# EAGLE design ARUv1 (EAGLE 6.1)
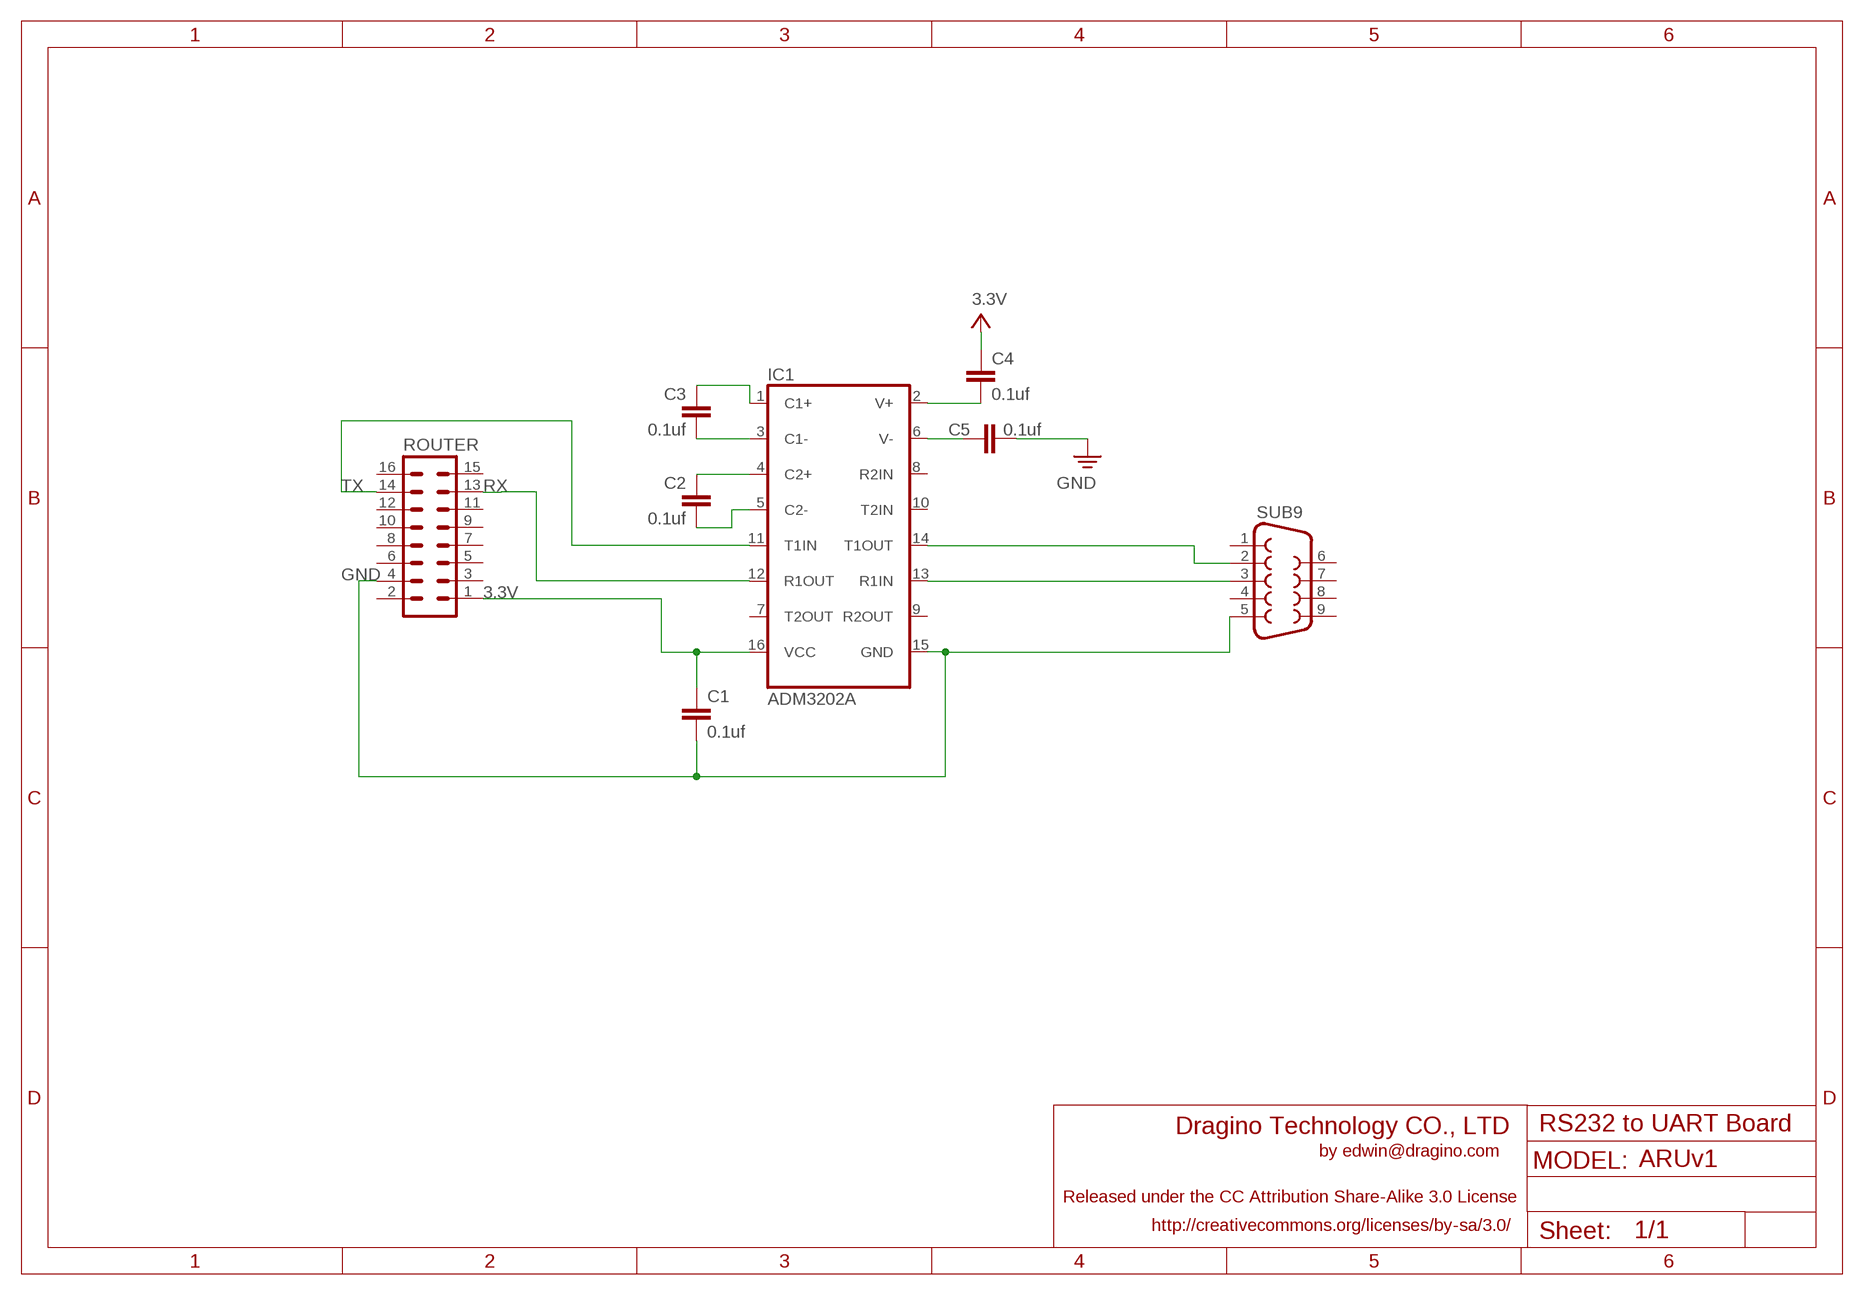
[diagram p0: schematic, sheet 1]

## Parts
C1  0.1uf  C-EUC0402  [C0402]
C2  0.1uf  C-EUC0402  [C0402]
C3  0.1uf  C-EUC0402  [C0402]
C4  0.1uf  C-EUC0402  [C0402]
C5  0.1uf  C-EUC0402  [C0402]
IC1  ADM3202A  MAX3221CUE  [TSSOP16]
ROUTER  MA08-2  [MA08-2]
SUB9  F09HP  [F09HP]

## Nets
3.3V: C1.1 C4.1 IC1.16(VCC) ROUTER.1
GND: C1.2 C5.1 IC1.15(GND) ROUTER.4 SUB9.5
N$1: C2.1 IC1.5(C2-)
N$2: C2.2 IC1.4(C2+)
N$3: C3.2 IC1.3(C1-)
N$4: C3.1 IC1.1(C1+)
N$5: C4.2 IC1.2(V+)
N$6: C5.2 IC1.6(V-)
N$7: IC1.14(T1OUT) SUB9.2
N$8: IC1.13(R1IN) SUB9.3
RX: IC1.12(R1OUT) ROUTER.13
TX: IC1.11(T1IN) ROUTER.14
Unconnected: IC1.7(T2OUT) IC1.8(R2IN) IC1.9(R2OUT) IC1.10(T2IN) ROUTER.2 ROUTER.3 ROUTER.5 ROUTER.6 ROUTER.7 ROUTER.8 ROUTER.9 ROUTER.10 ROUTER.11 ROUTER.12 ROUTER.15 ROUTER.16 SUB9.1 SUB9.4 SUB9.6 SUB9.7 SUB9.8 SUB9.9

## Notes on the sheet
- RS232 to UART Board

## Library data of the parts
C1-C5 = resistor:C-EU: CAPACITOR, European symbol
IC1 = maxim - ??:MAX3221*: RS-232 Transceivers with AutoShutdown 1µA Supply-Current, True +3V to +5.5V http://dbserv.maxim-ic.com/; MF: MAXIM; MPN: MAX3221CUE+; OC_FARNELL: 1379915; OC_NEWARK: 68K4608
ROUTER = con-lstb:MA08-2: PIN HEADER; OC_FARNELL: unknown; OC_NEWARK: unknown
SUB9 = con-subd:F09: SUB-D; OC_FARNELL: unknown; OC_NEWARK: unknown

## Board
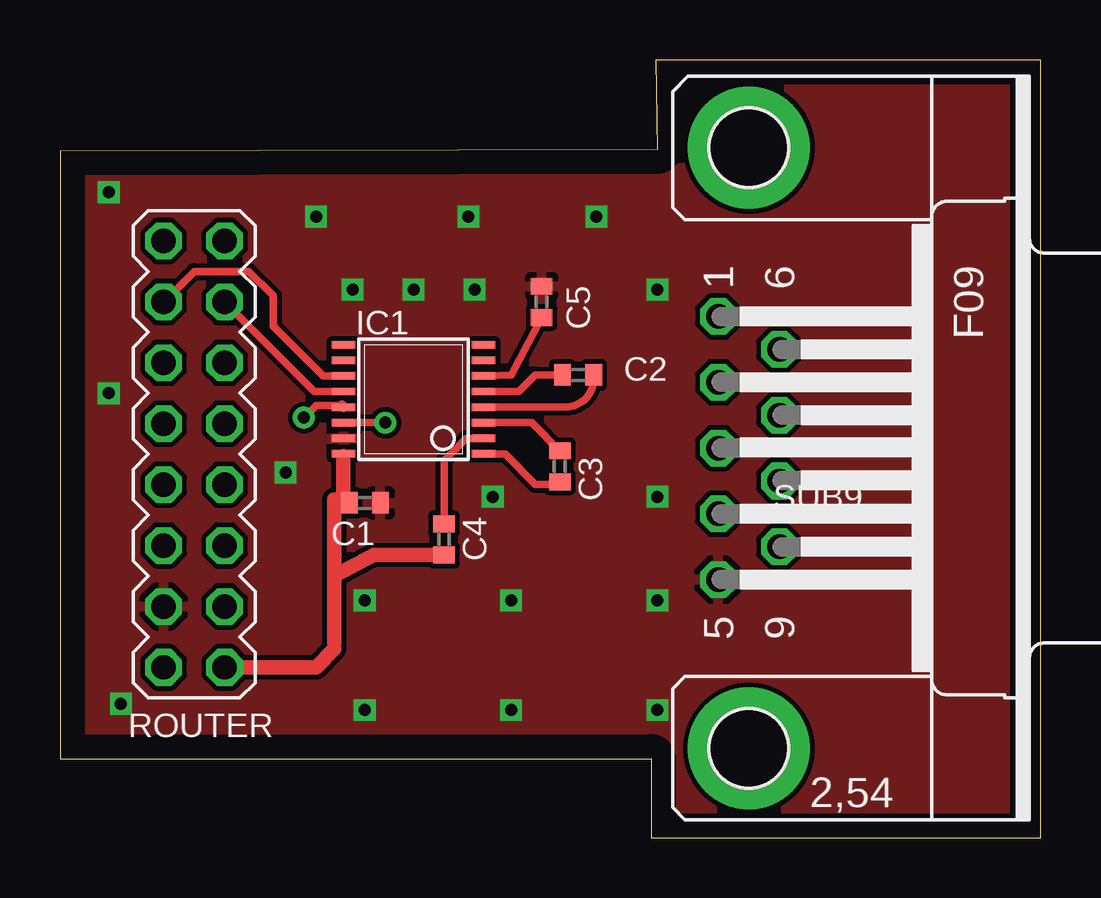
[diagram p1: board, top side]
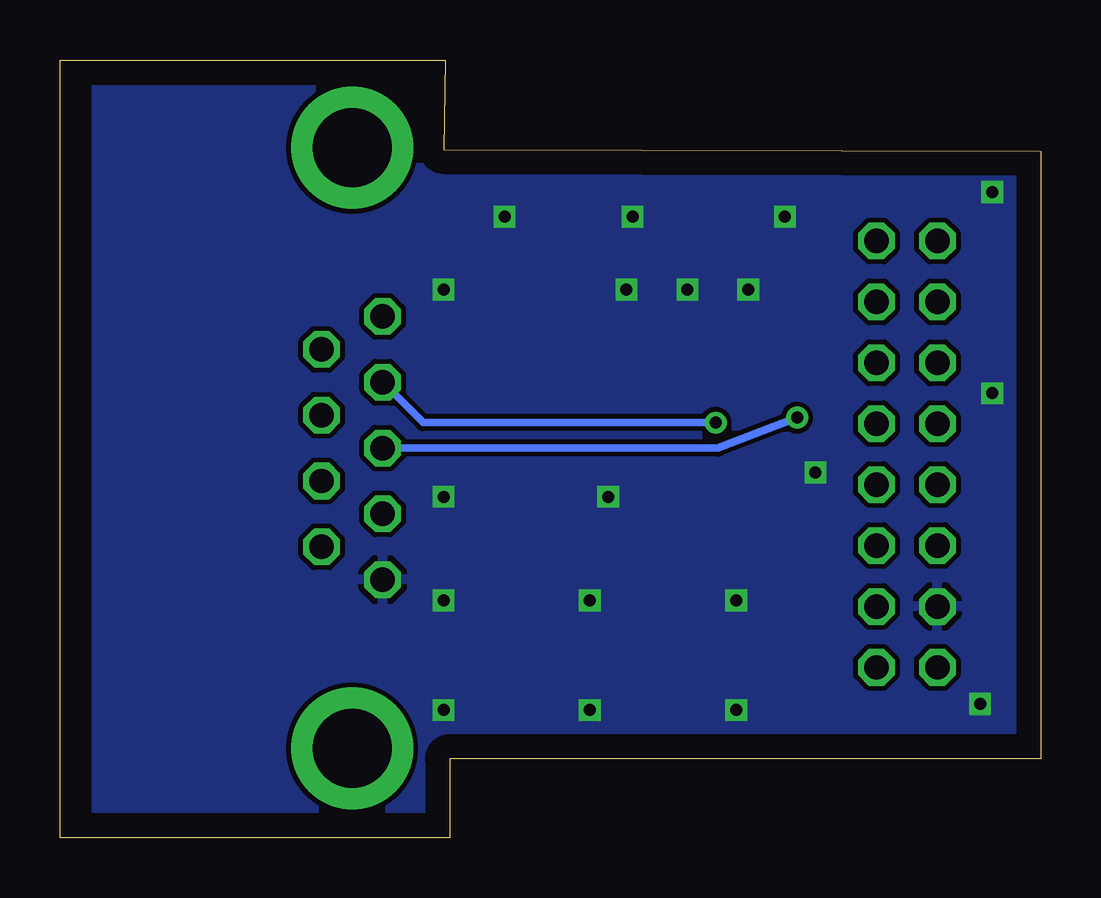
[diagram p2: board, bottom side, seen from below]

Size 40.87 x 32.44 mm. Coordinates in mm from the lower left corner, seen from the top.
Outline: 0,3.3 24.64,3.3 24.64,0 40.87,0 40.87,32.44 24.82,32.44 24.89,28.7 0,28.63 0,3.3
Copper layers (1*16): GND 0.035mm / dielectric 1.5mm / Bottom 0.035mm
Design rules: minimum track width 10mil, minimum drill 18mil, track to track 8mil, track to pad 8mil, pad to pad 8mil, via to via 8mil, smd to smd 8mil, copper to edge 40mil, drill to drill 8mil, minimum pad ring 10mil, minimum via ring 8mil, stop-mask expansion 4mil, vias tented up to drill 20mil, thermal gap 10mil

### Footprints (pad centres in the part's own frame; a part is rotated, then mirrored left to right if it is on the bottom)
C0402 = smd 0.7 x 0.9: 1 -0.65,0; 2 0.65,0
TSSOP16 = smd 0.305 x 0.991: 1 -2.275,-2.918; 2 -1.625,-2.918; 3 -0.975,-2.918; 4 -0.325,-2.918; 5 0.325,-2.918; 6 0.975,-2.918; 7 1.625,-2.918; 8 2.275,-2.918; 9 2.275,2.918; 10 1.625,2.918; 11 0.975,2.918; 12 0.325,2.918; 13 -0.325,2.918; 14 -0.975,2.918; 15 -1.625,2.918; 16 -2.275,2.918
MA08-2 = drill 1.016 octagon: 1 -8.89,-1.27; 2 -8.89,1.27; 3 -6.35,-1.27; 4 -6.35,1.27; 5 -3.81,-1.27; 6 -3.81,1.27; 7 -1.27,-1.27; 8 -1.27,1.27; 9 1.27,-1.27; 10 1.27,1.27; 11 3.81,-1.27; 12 3.81,1.27; 13 6.35,-1.27; 14 6.35,1.27; 15 8.89,-1.27; 16 8.89,1.27
F09HP = drill 1.016 octagon: 1 -5.486,-1.27; 2 -2.743,-1.27; 3 0,-1.27; 4 2.743,-1.27; 5 5.486,-1.27; 6 -4.115,1.27; 7 -1.372,1.27; 8 1.372,1.27; 9 4.115,1.27 | drill 3.302 pad 5.08: G1 -12.522,0; G2 12.522,0

### Placement (x,y rotation side)
C1  12.7,13.97 0 top
C2  21.59,19.3 0 top
C3  20.83,15.49 90 top
C4  16,12.45 90 top
C5  20.07,22.35 270 top
IC1  14.73,18.29 90 top
ROUTER  5.59,16 90 top
SUB9  28.7,16.26 270 top
U$1  [LOGO-SILK-15MM]  14.73,25.15 0 top

### Tracks (layer width: path | path; a pad name or v marks a point on that pad's centre or on a via)
3.3V
  GND 0.406: C1.1 11.8,14.22 11.43,14.11 | 11.8,15.74 IC1.16 | 11.43,11.68 11.54,11.8 | 11.43,7.87 11.43,8.13
  GND 0.61: 11.43,10.92 11.43,11.68 11.43,14.11 | 11.8,14.22 11.8,15.74 | 11.43,10.92 13.07,11.8 C4.1 | 11.43,8.13 11.43,10.92 | 11.43,7.87 10.67,7.11 ROUTER.1
GND  (via drill 0.5)
  other vias: 24.89,5.33 18.8,5.33 12.7,5.33 2.54,5.59 24.89,9.91 18.8,9.91 12.7,9.91 24.89,14.22 18.03,14.22 12.19,22.86 14.73,22.86 17.27,22.86 9.4,15.24 24.89,22.86 2.03,26.92 10.67,25.91 2.03,18.54 22.35,25.91 17.02,25.91
  pour GND: -0.25,28.96 25.15,28.96 25.15,32.26 39.37,32.51 39.37,0.51 25.15,0.25 25.15,3.56 0.51,3.56 -0.25,3.81
  pour Bottom: 0.25,28.7 24.89,28.7 24.89,32.51 39.37,32.51 39.37,0 24.64,0 24.64,3.56 0,3.56
N$1
  GND 0.305: IC1.5 19.12,18.61 19.81,19.3 C2.1
N$2
  GND 0.305: IC1.4 21.15,17.96 arc90 C2.2
N$3
  GND 0.305: IC1.3 19.66,17.31 C3.2
N$4
  GND 0.305: IC1.1 18.53,16.01 18.54,16 19.81,14.73 20.72,14.73
  GND 0.406: 20.72,14.73 C3.1
N$5
  GND 0.305: C4.2 16,15.75 16.92,16.66 IC1.2
N$6
  GND 0.305: C5.2 18.8,19.3 IC1.6
N$7  (via drill 0.5)
  GND 0.305: IC1.14 v13.55,17.31
  Bottom 0.305: v13.55,17.31 25.75,17.31 SUB9.2
N$8  (via drill 0.5)
  GND 0.305: v10.16,17.53 10.67,18.03 11.74,18.03
  GND 0.406: 11.74,18.03 IC1.13
  Bottom 0.305: SUB9.3 13.46,16.26 v10.16,17.53
RX
  GND 0.305: IC1.12 10.6,18.61 ROUTER.13
TX
  GND 0.305: IC1.11 10.96,19.26 8.89,21.34 8.89,22.61 7.87,23.62 5.59,23.62 5.33,23.37 ROUTER.14

### Text on the board
tDocu: TX | RX | GND | 3.3V | Model: ARU v1.1 | RS232 UART Converter